# EAGLE design Ethernet Shield (EAGLE 7.2.0)
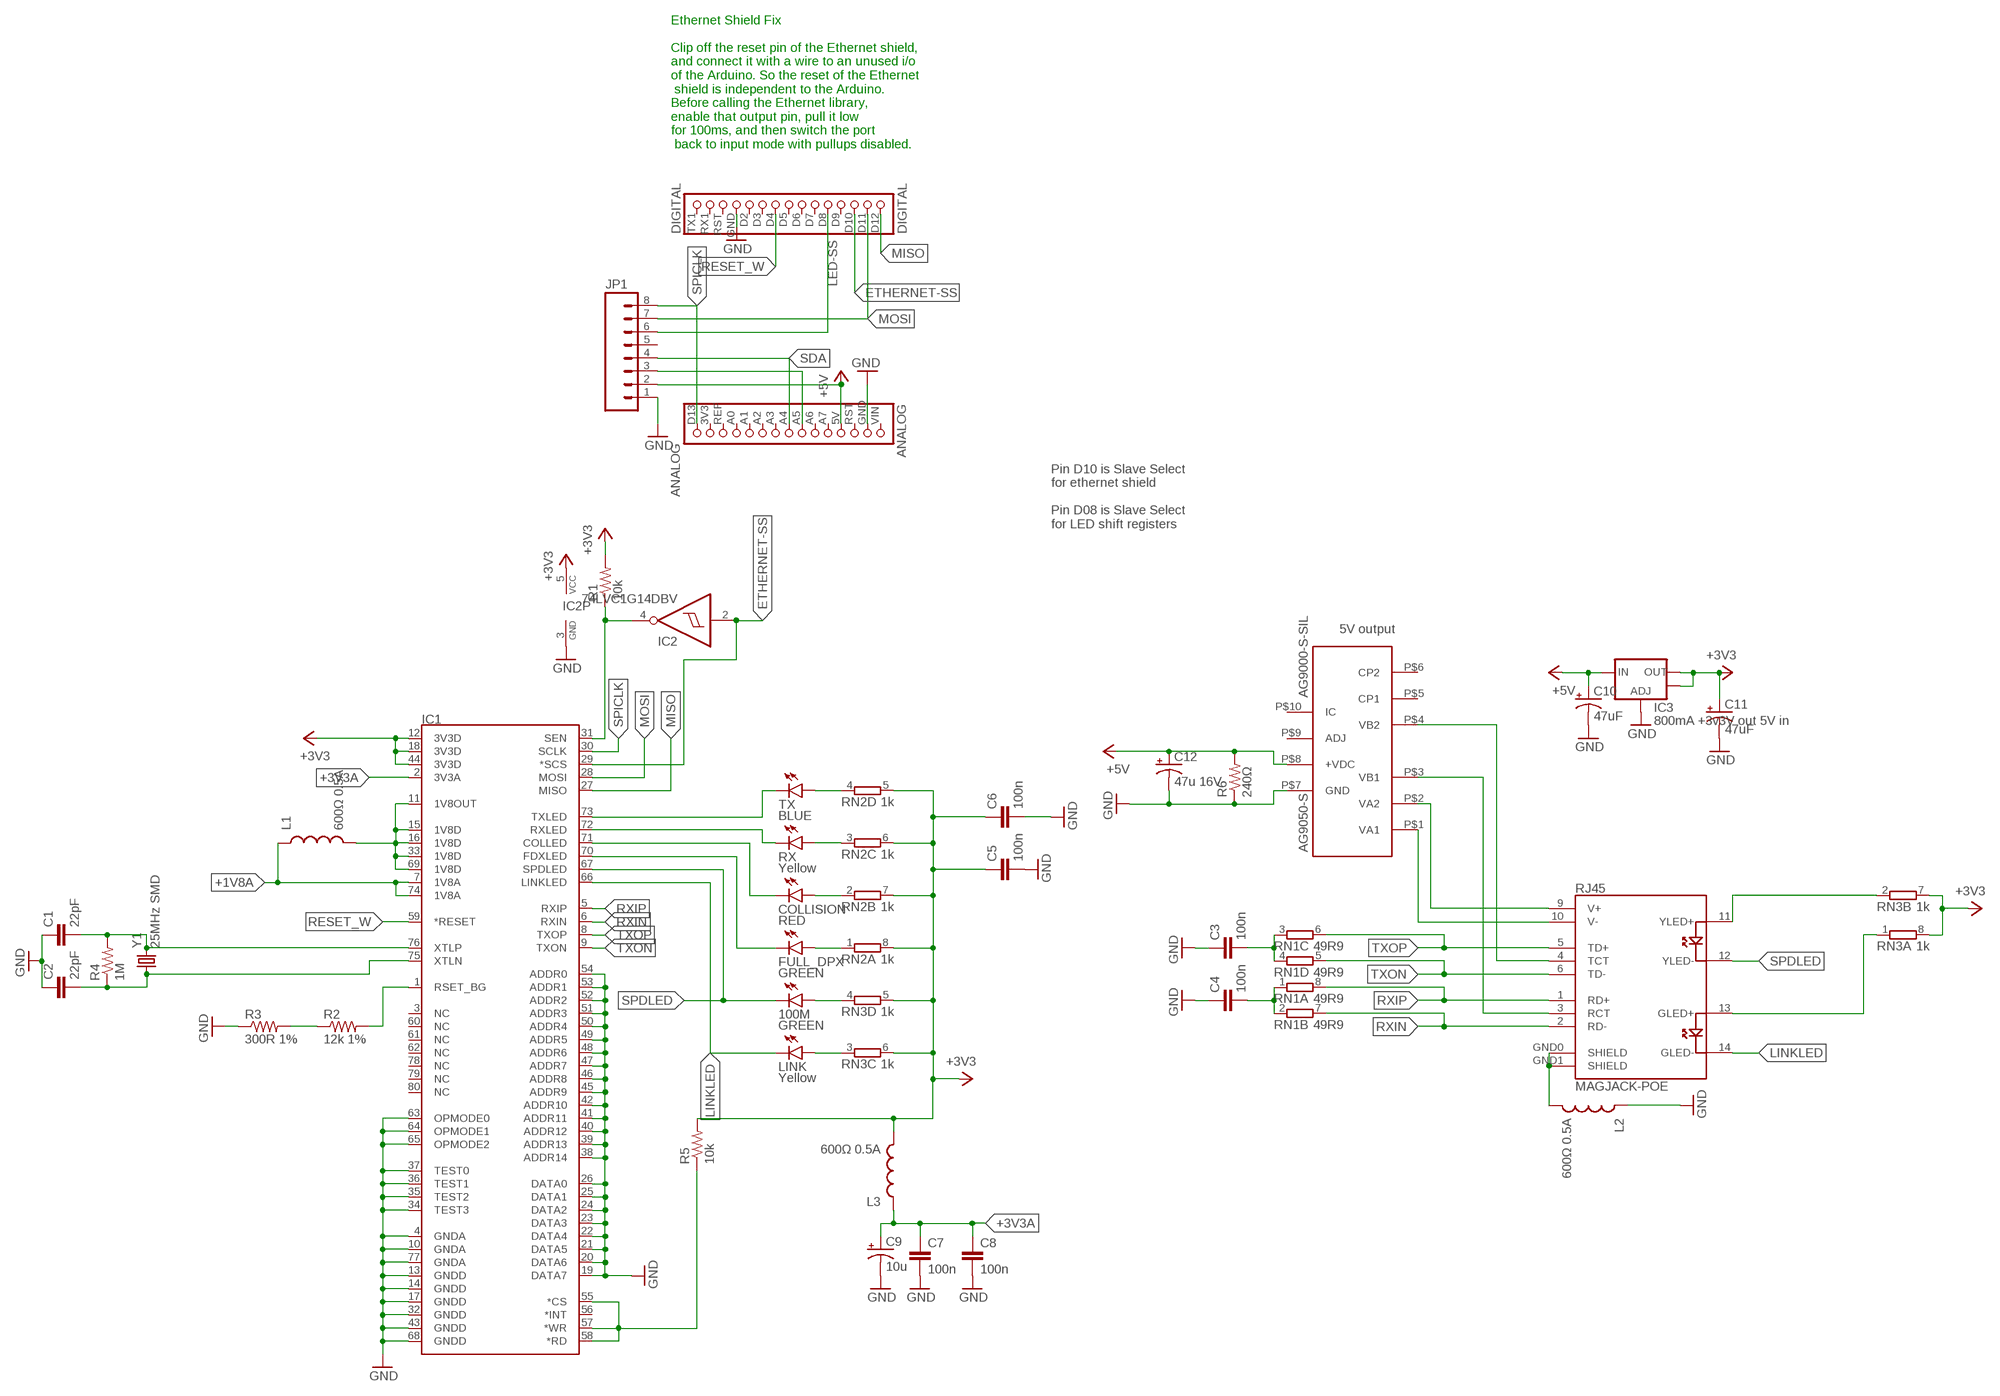
[diagram p0: schematic, sheet 1]

## Parts
100M  GREEN  LED-GREEN0603  [LED-0603]
AG9050-S  AG9000-S-SIL  [AG9000-S]
ANALOG  ANALOG  [A1X15]
C1  22pF  22PF-50V-5%(0603)  [0603-CAP]
C2  22pF  22PF-50V-5%(0603)  [0603-CAP]
C3  100n  CAP0402-CAP  [0402-CAP]
C4  100n  CAP0402-CAP  [0402-CAP]
C5  100n  CAP0402-CAP  [0402-CAP]
C6  100n  CAP0402-CAP  [0402-CAP]
C7  100n  CAP0402-CAP  [0402-CAP]
C8  100n  CAP0402-CAP  [0402-CAP]
C9  10u  CAP_POL1206  [EIA3216]
C10  47uF  47UF-10V-10%(TANT)  [EIA3528]
C11  47uF  47UF-10V-10%(TANT)  [EIA3528]
C12  47u 16V  CAP_POL1206  [EIA3216]
COLLISION  RED  LED-RED0603  [LED-0603]
DIGITAL  DIGITAL  DIGITALDIGITAL''  [1X15]
FULL_DPX  GREEN  LED-GREEN0603  [LED-0603]
IC1  W5100  [LQFP-80]
IC2  74LVC1G14DBV  [SOT23-5]
IC3  800mA +3v3V out 5V in  V_REG_LM1117SOT223  [SOT223]
JP1  M08  [1X08_ROUND]
L1  600Ω 0.5A  INDUCTOR0805  [0805]
L2  600Ω 0.5A  INDUCTOR0805  [0805]
L3  600Ω 0.5A  INDUCTOR0805  [0805]
LINK  Yellow  LED-YELLOW0603  [LED-0603]
R1  10k  RESISTOR0402-RES  [0402-RES]
R2  12k 1%  RESISTOR0402-RES  [0402-RES]
R3  300R 1%  RESISTOR0402-RES  [0402-RES]
R4  1M  RESISTOR0402-RES  [0402-RES]
R5  10k  RESISTOR0402-RES  [0402-RES]
R6  240Ω  RESISTOR0402-RES  [0402-RES]
RJ45  MAGJACK-POE  [MAGJACK-POE]
RN1  49R9  4R-NCAY16  [CAY16]
RN2  1k  4R-NCAY16  [CAY16]
RN3  1k  4R-NCAY16  [CAY16]
RX  Yellow  LED-YELLOW0603  [LED-0603]
TX  BLUE  LED-BLUE0603  [LED-0603]
Y1  25MHz SMD  CRYSTALSMD  [HC49UP]

## Nets
1V8: IC1.11(1V8OUT) IC1.15(1V8D) IC1.16(1V8D) IC1.33(1V8D) IC1.69(1V8D) L1.2
+1V8A [Power]: IC1.7(1V8A) IC1.74(1V8A) L1.1
+3V3 [Power]: C5.1 C6.1 C11.A(+) IC1.12(3V3D) IC1.18(3V3D) IC1.44(3V3D) IC2.5(VCC) IC3.2(OUT) IC3.4(OUT) L3.2 R1.2 R5.2 RN2.5 RN2.6 RN2.7 RN2.8 RN3.5 RN3.6 RN3.7 RN3.8
+3V3A [Power]: C7.1 C8.1 C9.A(+) IC1.2(3V3A) L3.1
+5V [Power]: AG9050-S.P$8(+VDC) ANALOG.5V C10.A(+) C12.A(+) IC3.3(IN) JP1.2 R6.2
ETHERNET-SS: DIGITAL.D10 IC1.29(*SCS) IC2.2(I)
GND [GND]: AG9050-S.P$7(GND) ANALOG.GND C1.1 C2.1 C3.1 C4.1 C5.2 C6.2 C7.2 C8.2 C9.C(-) C10.C(-) C11.C(-) C12.C(-) DIGITAL.GND IC1.4(GNDA) IC1.10(GNDA) IC1.13(GNDD) IC1.14(GNDD) IC1.17(GNDD) IC1.19(DATA7) IC1.20(DATA6) IC1.21(DATA5) IC1.22(DATA4) IC1.23(DATA3) IC1.24(DATA2) IC1.25(DATA1) IC1.26(DATA0) IC1.32(GNDD) IC1.34(TEST3) IC1.35(TEST2) IC1.36(TEST1) IC1.37(TEST0) IC1.38(ADDR14) IC1.39(ADDR13) IC1.40(ADDR12) IC1.41(ADDR11) IC1.42(ADDR10) IC1.43(GNDD) IC1.45(ADDR9) IC1.46(ADDR8) IC1.47(ADDR7) IC1.48(ADDR6) IC1.49(ADDR5) IC1.50(ADDR4) IC1.51(ADDR3) IC1.52(ADDR2) IC1.53(ADDR1) IC1.54(ADDR0) IC1.63(OPMODE0) IC1.64(OPMODE1) IC1.65(OPMODE2) IC1.68(GNDD) IC1.77(GNDA) IC2.3(GND) IC3.1(ADJ) JP1.1 L2.1 R3.1 R6.1
LED-SS: DIGITAL.D8 JP1.6
LINKLED: IC1.66(LINKLED) LINK.C RJ45.14(GLED-)
MISO: DIGITAL.D12 IC1.27(MISO)
MOSI: DIGITAL.D11 IC1.28(MOSI) JP1.7
N$1: IC1.1(RSET_BG) R2.2
N$3: R2.1 R3.2
N$4: C1.2 IC1.76(XTLP) R4.2 Y1.2
N$5: C2.2 IC1.75(XTLN) R4.1 Y1.1
N$6 [GND]: L2.2 RJ45.GND0(SHIELD) RJ45.GND1(SHIELD)
N$7 [Power]: AG9050-S.P$1(VA1) RJ45.10(V-)
N$8 [Power]: AG9050-S.P$2(VA2) RJ45.9(V+)
N$9 [Power]: AG9050-S.P$4(VB2) RJ45.4(TCT)
N$10 [Power]: AG9050-S.P$3(VB1) RJ45.3(RCT)
N$11: C3.2 RN1.3 RN1.4
N$12: C4.2 RN1.1 RN1.2
N$13: COLLISION.C IC1.71(COLLED)
N$14: FULL_DPX.C IC1.70(FDXLED)
N$15: RJ45.11(YLED+) RN3.2
N$16: RJ45.13(GLED+) RN3.1
N$17: FULL_DPX.A RN2.1
N$18: COLLISION.A RN2.2
N$19: RN2.3 RX.A
N$20: RN2.4 TX.A
N$21: LINK.A RN3.3
N$22: 100M.A RN3.4
N$23: IC1.55(*CS) IC1.57(*WR) IC1.58(*RD) R5.1
RESET_W: DIGITAL.D4 IC1.59(*RESET)
RXIN: IC1.6(RXIN) RJ45.2(RD-) RN1.7
RXIP: IC1.5(RXIP) RJ45.1(RD+) RN1.8
RXLED: IC1.72(RXLED) RX.C
SCL: ANALOG.A5 JP1.3
SDA: ANALOG.A4 JP1.4
SEN: IC1.31(SEN) IC2.4(O) R1.1
SPDLED: 100M.C IC1.67(SPDLED) RJ45.12(YLED-)
SPICLK: ANALOG.D13 IC1.30(SCLK) JP1.8
TXLED: IC1.73(TXLED) TX.C
TXON: IC1.9(TXON) RJ45.6(TD-) RN1.5
TXOP: IC1.8(TXOP) RJ45.5(TD+) RN1.6
Unconnected: AG9050-S.P$5(CP1) AG9050-S.P$6(CP2) AG9050-S.P$9(ADJ) AG9050-S.P$10(IC) ANALOG.3V3 ANALOG.A0 ANALOG.A1 ANALOG.A2 ANALOG.A3 ANALOG.A6 ANALOG.A7 ANALOG.REF ANALOG.RST ANALOG.VIN DIGITAL.D2 DIGITAL.D3 DIGITAL.D5 DIGITAL.D6 DIGITAL.D7 DIGITAL.D9 DIGITAL.RST DIGITAL.RX1 DIGITAL.TX1 IC1.3(NC) IC1.56(*INT) IC1.60(NC) IC1.61(NC) IC1.62(NC) IC1.78(NC) IC1.79(NC) IC1.80(NC) JP1.5

## Notes on the sheet
- Ethernet Shield Fix
  
  Clip off the reset pin of the Ethernet shield, 
  and connect it with a wire to an unused i/o 
  of the Arduino. So the reset of the Ethernet
   shield is independent to the Arduino. 
  Before calling the Ethernet library,  
  enable that output pin, pull it low 
  for 100ms, and then switch the port
   back to input mode with pullups disabled.
- Pin D10 is Slave Select
  for ethernet shield
  
  Pin D08 is Slave Select
  for LED shift registers
- 5V output

## Library data of the parts
100M FULL_DPX = SparkFun-LED:LED-GREEN: Various green LEDs Green LEDs used in SFE Production 0603- DIO-00821 LARGE- DIO-00862 LILYPAD- DIO-09910; PROD_ID: DIO-00821
AG9050-S = Power Over Ethernet Autonegotiator:AG9000-S: AG9000-S Power Over Ethernet Module Pinout Pin # Name Description 1 VA1 RX Input (1). This input pin is used in conjunction with VA2 and connects to the centre tap of the transformer connected to pins 1 & 2 of the RJ45 connector (RX) - it is not polarity sensitive. 2 VA2 TX Input (2). This input pin is used in conjunction with VA1 and connects to the centre tap of the transformer connected to pins 3 & 6 of the RJ45 connector (TX) - it is not polarity sensitive. 3 VB1 Direct Input (1). This input pin is used in conjunction with VB2 and connects to pin 4 & 5 of the RJ45 connector - it is not polarity sensitive. 4 VB2 Direct Input (2). This input pin is used in conjunction with VB1 and connects to pin 7 & 8 of the RJ45 connector - it is not polarity sensitive. 5 CP1 Class Programming (1). Connect an external resistor to CP2 will change the current class of the module. With no resistor fitted the Ag9000 will default to Class 0. 6 CP2 Class Programming (2). Connect an external resistor to CP1 will change the current class of the module. With no resistor fitted the Ag9000 will default to Class 0. 7 GND Ground. The ground return for the +VDC output. 8 +VDC DC Output. This pin provides the regulated output from the DC/DC converter. 9 ADJ Output Adjust. The output voltage can be adjusted from its nominal value, by connecting an external resistor from this pin to either the +VDC pin or the GND pin. 10 IC Internal Connection. Do not connect to this pin. Data Sheet <http://arduino.cc/en/uploads/Main/PoE-datasheet.pdf>
ANALOG = Arduino Nano Pin Headers:ANALOG: analog pins of arduino
C1 C2 = SparkFun-Capacitors:22PF-50V-5%(0603): CAP-07876; PROD_ID: CAP-07876
C3-C8 = SparkFun-Capacitors:CAP: Capacitor Standard 0603 ceramic capacitor, and 0.1" leaded capacitor.
C9 C12 = SparkFun-Capacitors:CAP_POL: Capacitor Polarized These are standard SMD and PTH capacitors. Normally 10uF, 47uF, and 100uF in electrolytic and tantalum varieties. Always verify the external diameter of the through hole cap, it varies with capacity, voltage, and manufacturer. The EIA devices should be standard.
C10 C11 = SparkFun-Capacitors:47UF-10V-10%(TANT): CAP-08310 47uF Tantalum SMT 10V 10% (EIA-3528); PROD_ID: CAP-08310
COLLISION = SparkFun-LED:LED-RED: Assorted Red LEDs LilyPad 1206- DIO-09912 1206- DIO-00809 0603- DIO-00819; PROD_ID: DIO-00819
DIGITAL = Arduino Nano Pin Headers:DIGITAL: PIN HEADER
IC1 = SparkFun-DigitalIC:W5100: WIZnet W5100 TCP/IP PHY Embedded Chip See SparkFun catalog # COM-09471 Package: LQFP-80,10x10mm, 0.4mm pitch
IC2 = 74xx-little-us:74*1G14: Single Schmitt-Trigger Inverter Gate
IC3 = SparkFun-PowerIC:V_REG_LM1117: Voltage Regulator LM1117 Standard adjustable voltage regulator but in SMD form. Spark Fun Electronics SKU : COM-00595; PROD_ID: VREG-08170
JP1 = SparkFun-Connectors:M08: Header 8 Standard 8-pin 0.1" header. Use with straight break away headers (SKU : PRT-00116), right angle break away headers (PRT-00553), swiss pins (PRT-00743), machine pins (PRT-00117), and female headers (PRT-00115).
L1-L3 = SparkFun-Passives:INDUCTOR: Inductors Basic Inductor/Choke - 0603 and 1206. Footprints are not proven and vary greatly between part numbers. SRN6045- 33uH, 20% 1.4A SDR0403-560KL - 56uH, 10%, 500mA RMS/740mA peak
LINK RX = SparkFun-LED:LED-YELLOW: Yellow SMD LEDs LilyPad 1206- DIO-09909 0603- DIO-09003; PROD_ID: DIO-09003
R1-R6 = SparkFun-Passives:RESISTOR: Resistor Basic schematic elements and footprints for 0603, 1206, and PTH resistors.
RJ45 = SparkFun-Connectors:MAGJACK-POE: PoE compatible MagJack
RN1-RN3 = resistor-dil:4R-N: Array Chip Resistor Source: RS Component / Phycomp; OC_FARNELL: unknown; OC_NEWARK: unknown
TX = SparkFun-LED:LED-BLUE: Blue LEDs for production use Various blue LEDs stocked by SparkFun production 0603 - DIO-08575 Rebel - DIO-09553 1206 - DIO-09911; PROD_ID: DIO-08575
Y1 = SparkFun-FreqCtrl:CRYSTAL: Various standard crystals. Proven footprints.

## Net classes
0 Signal: width 0.203 mm
1 GND: width 0.406 mm
2 Power: width 0.406 mm

## Board
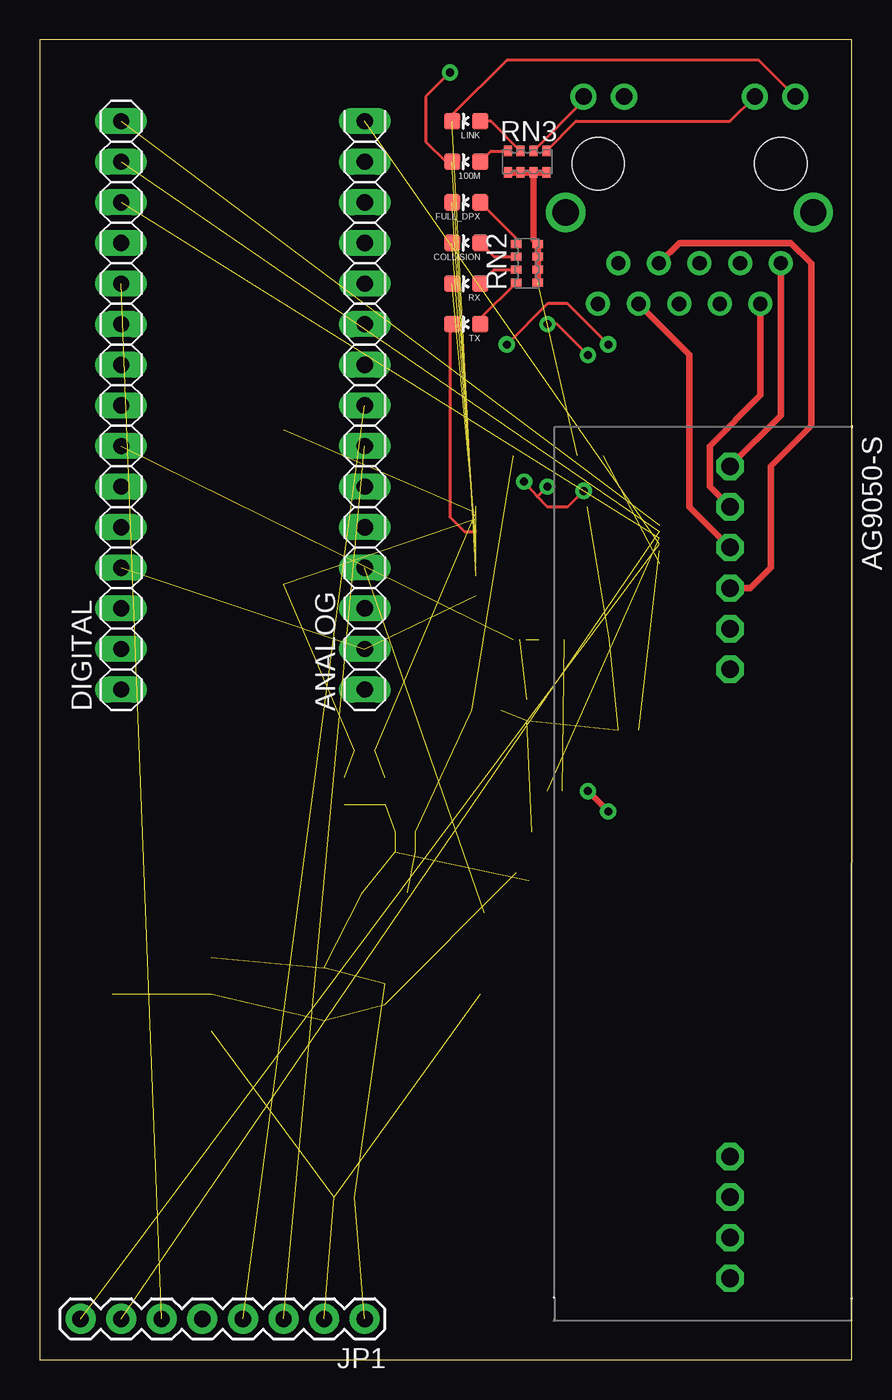
[diagram p1: board, top side]
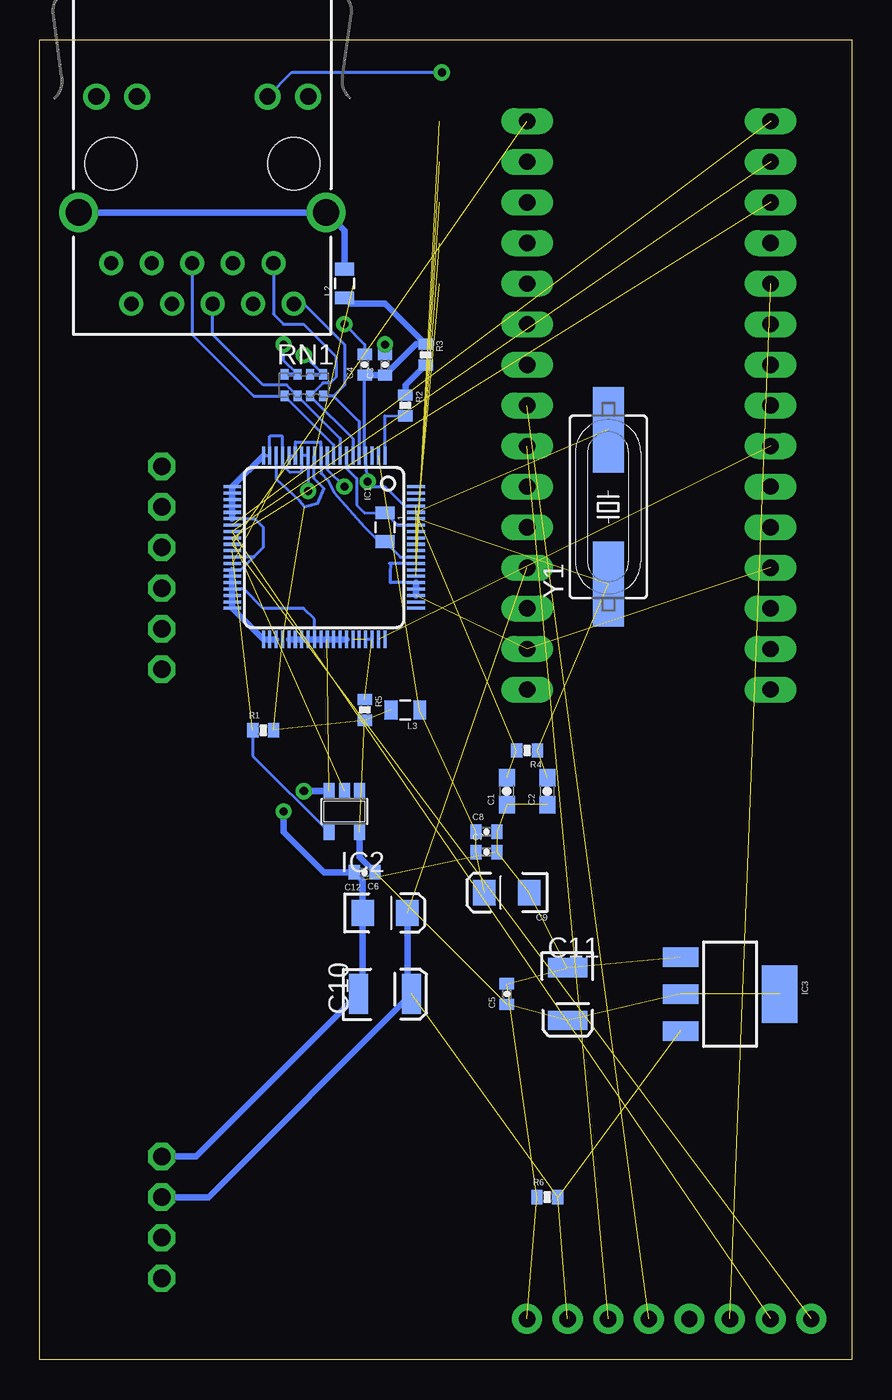
[diagram p2: board, bottom side, seen from below]

Size 50.8 x 82.55 mm. Coordinates in mm from the lower left corner, seen from the top.
Outline: 0,0 50.8,0 50.8,82.55 0,82.55 0,0
Copper layers (1*16): Top 0.035mm / dielectric 1.5mm / Bottom 0.035mm
Design rules "SparkFun": minimum track width 8mil, minimum drill 20mil, track to track 8mil, track to pad 8mil, pad to pad 8mil, via to via 8mil, smd to smd 8mil, copper to edge 10mil, drill to drill 8mil, minimum pad ring 12mil, minimum via ring 10mil, stop-mask expansion 4mil, vias tented up to drill 25mil, thermal gap 10mil
tKeepout: area 8.9,43.2 to 15.2,47

### Footprints (pad centres in the part's own frame; a part is rotated, then mirrored left to right if it is on the bottom)
LED-0603 = smd 1 x 1: A 0,-0.877; C 0,0.877
AG9000-S = drill 1.1 octagon: P$1 2.54,0; P$2 5.08,0; P$3 7.62,0; P$4 10.16,0; P$5 12.7,0; P$6 15.24,0; P$7 45.72,0; P$8 48.26,0; P$9 50.8,0; P$10 53.34,0
A1X15 = drill 1.016 long: 3V3 15.24,0; 5V -10.16,0; A0 10.16,0; A1 7.62,0; A2 5.08,0; A3 2.54,0; A4 0,0; A5 -2.54,0; A6 -5.08,0; A7 -7.62,0; D13 17.78,0; GND -15.24,0; REF 12.7,0; RST -12.7,0; VIN -17.78,0
0603-CAP = smd 1.1 x 1: 1 -0.85,0; 2 0.85,0
0402-CAP = smd 0.7 x 0.9: 1 -0.65,0; 2 0.65,0
EIA3216 = smd 1.4 x 1.6: A 1.4,0; C -1.4,0
EIA3528 = smd 1.2 x 2.5: A 1.65,0; C -1.65,0
1X15 = drill 1.016 long: D2 -7.62,0; D3 -5.08,0; D4 -2.54,0; D5 0,0; D6 2.54,0; D7 5.08,0; D8 7.62,0; D9 10.16,0; D10 12.7,0; D11 15.24,0; D12 17.78,0; GND -10.16,0; RST -12.7,0; RX1 -15.24,0; TX1 -17.78,0
LQFP-80 = smd 0.19 x 1.1: 1 -3.8,-5.75; 2 -3.4,-5.75; 3 -3,-5.75; 4 -2.6,-5.75; 5 -2.2,-5.75; 6 -1.8,-5.75; 7 -1.4,-5.75; 8 -1,-5.75; 9 -0.6,-5.75; 10 -0.2,-5.75; 11 0.2,-5.75; 12 0.6,-5.75; 13 1,-5.75; 14 1.4,-5.75; 15 1.8,-5.75; 16 2.2,-5.75; 17 2.6,-5.75; 18 3,-5.75; 19 3.4,-5.75; 20 3.8,-5.75; 41 3.8,5.75; 42 3.4,5.75; 43 3,5.75; 44 2.6,5.75; 45 2.2,5.75; 46 1.8,5.75; 47 1.4,5.75; 48 1,5.75; 49 0.6,5.75; 50 0.2,5.75; 51 -0.2,5.75; 52 -0.6,5.75; 53 -1,5.75; 54 -1.4,5.75; 55 -1.8,5.75; 56 -2.2,5.75; 57 -2.6,5.75; 58 -3,5.75; 59 -3.4,5.75; 60 -3.8,5.75 | smd 1.1 x 0.19: 21 5.75,-3.8; 22 5.75,-3.4; 23 5.75,-3; 24 5.75,-2.6; 25 5.75,-2.2; 26 5.75,-1.8; 27 5.75,-1.4; 28 5.75,-1; 29 5.75,-0.6; 30 5.75,-0.2; 31 5.75,0.2; 32 5.75,0.6; 33 5.75,1; 34 5.75,1.4; 35 5.75,1.8; 36 5.75,2.2; 37 5.75,2.6; 38 5.75,3; 39 5.75,3.4; 40 5.75,3.8; 61 -5.75,3.8; 62 -5.75,3.4; 63 -5.75,3; 64 -5.75,2.6; 65 -5.75,2.2; 66 -5.75,1.8; 67 -5.75,1.4; 68 -5.75,1; 69 -5.75,0.6; 70 -5.75,0.2; 71 -5.75,-0.2; 72 -5.75,-0.6; 73 -5.75,-1; 74 -5.75,-1.4; 75 -5.75,-1.8; 76 -5.75,-2.2; 77 -5.75,-2.6; 78 -5.75,-3; 79 -5.75,-3.4; 80 -5.75,-3.8
SOT23-5 = smd 0.69 x 0.99: 1 -0.95,-1.29; 2 0,-1.29; 3 0.95,-1.29; 4 0.95,1.3; 5 -0.95,1.3
SOT223 = smd 1.219 x 2.235: 1 -2.311,-3.099; 2 0,-3.099; 3 2.311,-3.099 | smd 3.6 x 2.2: 4 0,3.099
1X08_ROUND = drill 1.016 pad 1.88: 1 0,0; 2 2.54,0; 3 5.08,0; 4 7.62,0; 5 10.16,0; 6 12.7,0; 7 15.24,0; 8 17.78,0
0805 = smd 0.8 x 1.2: 1 -0.9,0; 2 0.9,0
0402-RES = smd 0.7 x 0.9: 1 -0.65,0; 2 0.65,0
MAGJACK-POE = drill 0.89: 1 5.72,-8.89; 2 4.45,-6.35; 3 3.18,-8.89; 4 1.91,-6.35; 5 0.64,-8.89; 6 -0.63,-6.35; 7 -1.9,-8.89; 8 -3.17,-6.35; 9 -4.44,-8.89; 10 -5.71,-6.35 | drill 1.02: 11 6.625,4.08; 12 4.085,4.08; 13 -4.085,4.08; 14 -6.625,4.08 | drill 1.63: GND0 -7.745,-3.17; GND1 7.745,-3.17 | hole 3.25: -5.715,-0.12; 5.715,-0.12
CAY16 = smd 0.5 x 0.65: 1 -1.2,-0.675; 2 -0.4,-0.675; 3 0.4,-0.675; 4 1.2,-0.675; 5 1.2,0.675; 6 0.4,0.675; 7 -0.4,0.675; 8 -1.2,0.675
HC49UP = smd 5.334 x 1.93: 1 -4.826,0; 2 4.826,0

### Placement (x,y rotation side)
100M  26.67,74.93 90 top
AG9050-S  43.18,58.42 270 top
ANALOG  20.32,59.69 90 top
C1  21.59,35.56 90 bottom
C2  19.05,35.56 90 bottom
C3  29.21,62.23 90 bottom
C4  30.48,62.23 90 bottom
C5  21.59,22.86 90 bottom
C6  30.48,30.48 180 bottom
C7  22.86,31.75 0 bottom
C8  22.86,33.02 0 bottom
C9  21.59,29.21 180 bottom
C10  29.21,22.86 0 bottom
C11  17.78,22.86 270 bottom
C12  29.21,27.94 0 bottom
COLLISION  26.67,69.85 90 top
DIGITAL  5.08,59.69 90 top
FULL_DPX  26.67,72.39 90 top
IC1  33.02,50.8 180 bottom
IC2  31.75,34.29 180 bottom
IC3  7.62,22.86 270 bottom
JP1  20.32,2.54 180 top
L1  29.21,52.07 270 bottom
L2  31.75,67.31 90 bottom
L3  27.94,40.64 180 bottom
LINK  26.67,77.47 90 top
R1  36.83,39.37 0 bottom
R2  27.94,59.69 270 bottom
R3  26.67,62.87 270 bottom
R4  20.32,38.1 180 bottom
R5  30.48,40.64 270 bottom
R6  19.05,10.16 0 bottom
RJ45  40.64,74.93 0 bottom
RN1  34.29,60.96 180 bottom
RN2  30.48,68.58 270 top
RN3  30.48,74.93 180 top
RX  26.67,67.31 90 top
TX  26.67,64.77 90 top
Y1  15.24,53.34 90 bottom

### Tracks (layer width: path | path; a pad name or v marks a point on that pad's centre or on a via)
1V8  (1 unrouted)
  Bottom 0.203: IC1.16 IC1.15 34.82,57.4 33.22,57.4 IC1.11 33.22,55.45 32.77,54.99 32.38,54.23 30.48,52.07 29.58,51.17 L1.2 28.24,50.2 IC1.69
+1V8A
  Bottom 0.203: IC1.7 31.62,55.75 30.99,55.12 30.99,53.47 30.48,52.96 L1.1 28.44,52.2 IC1.74
+3V3  (10 unrouted)
  Top 0.406: RN3.5 RN3.6 RN3.7 | RN3.7 RN3.8 | RN3.7 30.88,70.06 RN2.8 RN2.7 RN2.6 RN2.5
  Bottom 0.203: IC1.18 36.02,55.07 34.54,53.72 34.26,53.38 33.4,53.59 33.02,54.48 33.66,55.12 33.66,56.52 IC1.12
  Bottom 0.406: IC2.5 30.8,31.45 C6.1
+3V3A  (4 unrouted)
+5V  (4 unrouted)
  Bottom 0.406: AG9050-S.P$8 40.26,10.16 C10.A 27.81,23.11 C12.A
ETHERNET-SS  (2 unrouted)
GND  (via drill 0.51)  (14 unrouted)
  Top 0.203: v34.02,54.34 33.02,53.34 31.75,53.34 31.11,53.98 | 31.11,53.98 v30.29,54.92 | v31.75,54.61 31.11,53.98
  Top 0.406: v35.56,34.29 v34.29,35.56
  Bottom 0.203: IC1.20 IC1.19 36.42,57.76 36.32,57.78 35.68,57.78 35.62,57.73 IC1.17 35.62,55.95 35.18,55.5 34.42,55.5 IC1.14 IC1.13 v34.02,54.34 | IC1.10 32.82,55.68 v31.75,54.61 | IC1.77 28,53.4 29.21,54.61 29.98,54.61 v30.29,54.92 IC1.4 30.48,56.61 C4.1 | IC1.26 37.36,52.6 36.83,52.07 36.83,50.8 37.43,50.2 | 37.43,50.2 IC1.32 | IC1.34 38.23,49.4 37.43,50.2 | IC1.49 33.62,46.32 34.29,46.99 36.83,46.99 38.04,48.2 IC1.37 | IC1.65 28.87,48.6 28.87,49.19 28.83,49.78 28.94,49.8 IC1.68
  Bottom 0.406: IC1.20 IC1.21 IC1.22 IC1.23 IC1.24 IC1.25 IC1.26 | C4.1 C3.1 27.27,63.52 R3.1 26.68,63.52 29.21,66.04 31.38,66.04 L2.1 | IC1.34 IC1.35 IC1.36 IC1.37 IC1.38 IC1.39 IC1.40 IC1.41 IC1.42 IC1.43 | IC1.54 IC1.53 IC1.52 IC1.51 | IC1.51 IC1.50 IC1.49 | IC1.51 IC1.48 IC1.47 IC1.46 IC1.45 | IC1.63 IC1.64 IC1.65 | AG9050-S.P$7 41.02,12.7 C10.C 30.61,23.11 C12.C 30.61,29.96 C6.2 33.02,30.48 35.56,33.02 v35.56,34.29 | v34.29,35.56 32.72,35.56 IC2.3
LED-SS  (1 unrouted)
LINKLED  (1 unrouted)
  Top 0.203: RJ45.14 44.99,81.28 29.21,81.28 25.79,77.86 LINK.C
MISO  (1 unrouted)
MOSI  (2 unrouted)
N$1
  Bottom 0.203: IC1.1 29.22,59.03 R2.2
N$3
  Bottom 0.406: R3.2 27.94,60.95 R2.1
N$4  (3 unrouted)
N$5  (3 unrouted)
N$6
  Bottom 0.406: RJ45.GND0 RJ45.GND1 31.75,70.61 L2.2
N$7
  Top 0.406: RJ45.10 46.35,59.05 AG9050-S.P$1
N$8
  Top 0.406: RJ45.9 45.08,60.32 41.91,57.15 41.91,54.61 AG9050-S.P$2
N$9
  Top 0.406: RJ45.4 40,69.85 46.99,69.85 48.26,68.58 48.26,58.42 45.72,55.88 45.72,49.53 44.45,48.26 AG9050-S.P$4
N$10
  Top 0.406: RJ45.3 40.64,62.86 40.64,53.34 AG9050-S.P$3
N$11  (via drill 0.51)
  Top 0.203: v35.56,63.5 33.02,66.04 31.75,66.04 v29.21,63.5
  Bottom 0.203: RN1.4 RN1.3 35.56,62.51 v35.56,63.5 | v29.21,63.5 C3.2
N$12  (via drill 0.51)
  Top 0.203: v34.29,62.84 32.35,64.77 v31.75,64.77
  Bottom 0.203: RN1.2 RN1.1 v34.29,62.84 | v31.75,64.77 30.48,63.5 C4.2
N$13  (1 unrouted)
N$14  (1 unrouted)
N$15
  Top 0.203: RN3.2 34.02,78.74 RJ45.11
N$16
  Top 0.203: RN3.1 33.55,77.47 43.18,77.47 RJ45.13
N$17
  Top 0.203: FULL_DPX.A 29.8,70.13 RN2.1
N$18
  Top 0.203: COLLISION.A 28.42,68.98 RN2.2
N$19
  Top 0.203: RX.A 28.42,68.18 RN2.3
N$20
  Top 0.203: RN2.4 27.55,65.12 TX.A
N$21
  Top 0.203: RN3.3 28.21,77.47 LINK.A
N$22
  Top 0.203: 100M.A 28.22,75.61 RN3.4
N$23  (2 unrouted)
  Bottom 0.203: IC1.58 IC1.57
RESET_W  (1 unrouted)
RXIN
  Bottom 0.203: RJ45.2 36.19,65.4 35.56,64.77 34.29,64.77 32.26,62.74 32.26,61.47 32.64,61.09 33.09,61.09 RN1.7 31.22,57.62 IC1.6
RXIP
  Bottom 0.203: RJ45.1 34.29,66.04 31.75,63.5 31.75,60.96 32.42,60.28 | 32.42,60.28 RN1.8 | 32.42,60.28 30.82,58.68 IC1.5
RXLED  (1 unrouted)
SCL  (1 unrouted)
SDA  (1 unrouted)
SEN  (1 unrouted)
  Bottom 0.203: R1.1 37.48,37.77 IC2.4
SPDLED  (via drill 0.51)  (1 unrouted)
  Top 0.203: v25.65,80.52 24.13,78.99 24.13,76.2 25.4,74.93 100M.C
  Bottom 0.203: RJ45.12 35.05,80.52 v25.65,80.52
SPICLK  (2 unrouted)
TXLED  (1 unrouted)
  Top 0.203: TX.C 25.65,64.63 25.65,52.7 26.56,51.8 IC1.73
TXON
  Bottom 0.203: RJ45.6 41.27,64.13 37.42,60.28 RN1.5 32.42,57.22 IC1.9
TXOP
  Bottom 0.203: RJ45.5 40,64.13 36.83,60.96 35.37,60.96 RN1.6 32.02,57.62 IC1.8

### Text on the board
tSilk: arduino on front